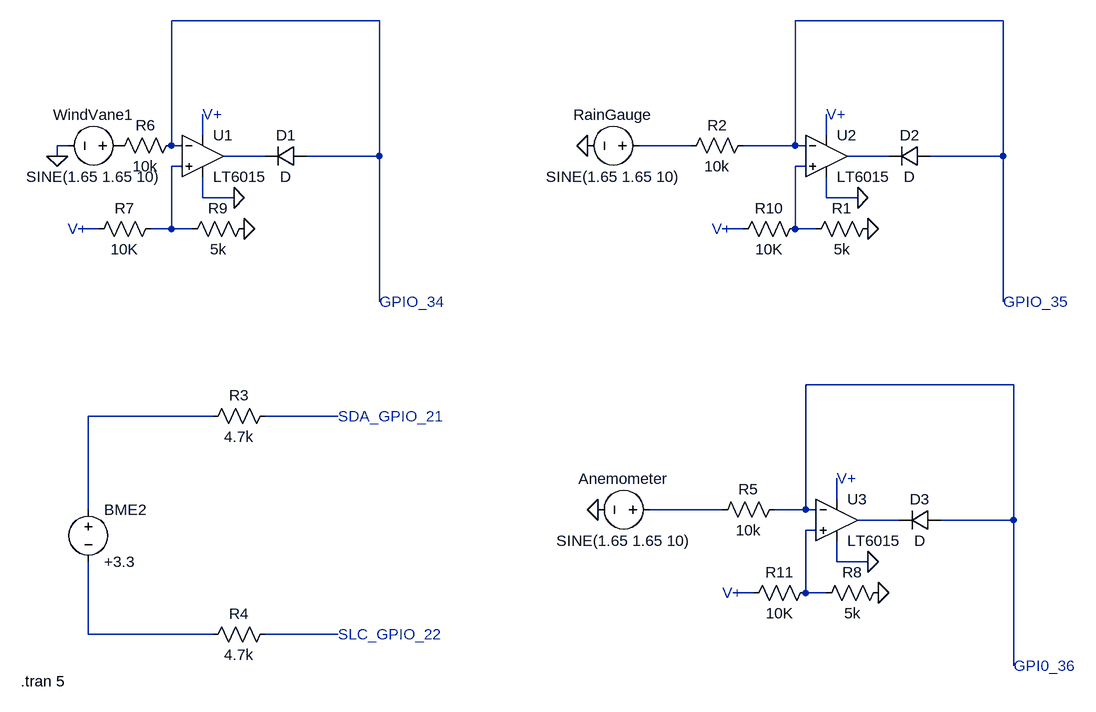
[diagram p0: schematic CircuitoAcopleCompleto.asc]
CircuitoAcopleCompleto.asc, the LTspice schematic file:
Version 4.1
SHEET 1 2424 1328
WIRE 912 -96 592 -96
WIRE 1872 -96 1552 -96
WIRE 640 80 640 48
WIRE 1600 80 1600 48
WIRE 432 96 416 96
WIRE 592 96 592 -96
WIRE 608 96 592 96
WIRE 1392 96 1312 96
WIRE 1552 96 1552 -96
WIRE 1552 96 1472 96
WIRE 1568 96 1552 96
WIRE 416 112 416 96
WIRE 736 112 672 112
WIRE 912 112 912 -96
WIRE 912 112 800 112
WIRE 1696 112 1632 112
WIRE 1872 112 1872 -96
WIRE 1872 112 1760 112
WIRE 608 128 592 128
WIRE 1568 128 1552 128
WIRE 640 176 640 144
WIRE 688 176 640 176
WIRE 1600 176 1600 144
WIRE 1648 176 1600 176
WIRE 480 224 448 224
WIRE 592 224 592 128
WIRE 592 224 560 224
WIRE 624 224 592 224
WIRE 1472 224 1440 224
WIRE 1552 224 1552 128
WIRE 1584 224 1552 224
WIRE 912 336 912 112
WIRE 1872 336 1872 112
WIRE 1888 464 1568 464
WIRE 656 512 464 512
WIRE 848 512 736 512
WIRE 1616 640 1616 608
WIRE 464 656 464 512
WIRE 1440 656 1328 656
WIRE 1568 656 1568 464
WIRE 1568 656 1520 656
WIRE 1584 656 1568 656
WIRE 1712 672 1648 672
WIRE 1888 672 1888 464
WIRE 1888 672 1776 672
WIRE 1584 688 1568 688
WIRE 1616 736 1616 704
WIRE 1664 736 1616 736
WIRE 1488 784 1456 784
WIRE 1568 784 1568 688
WIRE 1600 784 1568 784
WIRE 464 848 464 736
WIRE 656 848 464 848
WIRE 848 848 736 848
WIRE 1888 896 1888 672
FLAG 1232 96 0
FLAG 1248 656 0
FLAG 1664 224 0
FLAG 1648 176 0
FLAG 1680 784 0
FLAG 1664 736 0
FLAG 416 112 0
FLAG 704 224 0
FLAG 688 176 0
SYMBOL voltage 1328 96 R90
WINDOW 0 -32 56 VBottom 2
WINDOW 3 32 56 VTop 2
WINDOW 123 0 0 Left 0
WINDOW 39 0 0 Left 0
SYMATTR InstName RainGauge
SYMATTR Value SINE(1.65 1.65 10)
SYMBOL res 1488 80 R90
WINDOW 0 0 56 VBottom 2
WINDOW 3 32 56 VTop 2
SYMATTR InstName R2
SYMATTR Value 10k
SYMBOL voltage 1344 656 R90
WINDOW 0 -32 56 VBottom 2
WINDOW 3 32 56 VTop 2
WINDOW 123 0 0 Left 0
WINDOW 39 0 0 Left 0
SYMATTR InstName Anemometer
SYMATTR Value SINE(1.65 1.65 10)
SYMBOL res 1536 640 R90
WINDOW 0 0 56 VBottom 2
WINDOW 3 32 56 VTop 2
SYMATTR InstName R5
SYMATTR Value 10k
SYMBOL OpAmps\\LT6015 1600 112 R0
SYMATTR InstName U2
SYMBOL res 1680 208 R90
WINDOW 0 0 56 VBottom 2
WINDOW 3 32 56 VTop 2
SYMATTR InstName R1
SYMATTR Value 5k
SYMBOL diode 1760 96 R90
WINDOW 0 0 32 VBottom 2
WINDOW 3 32 32 VTop 2
SYMATTR InstName D2
SYMBOL OpAmps\\LT6015 1616 672 R0
SYMATTR InstName U3
SYMBOL res 1696 768 R90
WINDOW 0 0 56 VBottom 2
WINDOW 3 32 56 VTop 2
SYMATTR InstName R8
SYMATTR Value 5k
SYMBOL diode 1776 656 R90
WINDOW 0 0 32 VBottom 2
WINDOW 3 32 32 VTop 2
SYMATTR InstName D3
SYMBOL res 608 80 R90
WINDOW 0 0 56 VBottom 2
WINDOW 3 32 56 VTop 2
SYMATTR InstName R6
SYMATTR Value 10k
SYMBOL voltage 528 96 R90
WINDOW 0 -32 56 VBottom 2
WINDOW 3 32 56 VTop 2
WINDOW 123 0 0 Left 0
WINDOW 39 0 0 Left 0
SYMATTR InstName WindVane1
SYMATTR Value SINE(1.65 1.65 10)
SYMBOL OpAmps\\LT6015 640 112 R0
SYMATTR InstName U1
SYMBOL res 576 208 R90
WINDOW 0 0 56 VBottom 2
WINDOW 3 32 56 VTop 2
SYMATTR InstName R7
SYMATTR Value 10K
SYMBOL res 720 208 R90
WINDOW 0 0 56 VBottom 2
WINDOW 3 32 56 VTop 2
SYMATTR InstName R9
SYMATTR Value 5k
SYMBOL diode 800 96 R90
WINDOW 0 0 32 VBottom 2
WINDOW 3 32 32 VTop 2
SYMATTR InstName D1
SYMBOL voltage 464 640 R0
SYMATTR InstName BME2
SYMATTR Value +3.3
SYMBOL res 752 496 R90
WINDOW 0 0 56 VBottom 2
WINDOW 3 32 56 VTop 2
SYMATTR InstName R3
SYMATTR Value 4.7k
SYMBOL res 752 832 R90
WINDOW 0 0 56 VBottom 2
WINDOW 3 32 56 VTop 2
SYMATTR InstName R4
SYMATTR Value 4.7k
SYMBOL res 1568 208 R90
WINDOW 0 0 56 VBottom 2
WINDOW 3 32 56 VTop 2
SYMATTR InstName R10
SYMATTR Value 10K
SYMBOL res 1584 768 R90
WINDOW 0 0 56 VBottom 2
WINDOW 3 32 56 VTop 2
SYMATTR InstName R11
SYMATTR Value 10K
TEXT 1600 48 Left 2 ;V+
TEXT 1616 608 Left 2 ;V+
TEXT 912 336 Left 2 ;GPIO_34
TEXT 640 48 Left 2 ;V+
TEXT 432 224 Left 2 ;V+
TEXT 848 512 Left 2 ;SDA_GPIO_21
TEXT 848 848 Left 2 ;SLC_GPIO_22
TEXT 1872 336 Left 2 ;GPIO_35
TEXT 1888 896 Left 2 ;GPI0_36
TEXT 1424 224 Left 2 ;V+
TEXT 1440 784 Left 2 ;V+
TEXT 360 920 Left 2 !.tran 5

The netlist it stands for:
* CircuitoAcopleCompleto.asc
V§RainGauge N005 0 SINE(1.65 1.65 10)
R2 N002 N005 10k
V§Anemometer N016 0 SINE(1.65 1.65 10)
R5 N012 N016 10k
X§U2 N009 N002 N004 0 N007 LT6016  ; LT6015, pins In+ In- V+ V- OUT
R1 0 N009 5k
D2 N002 N007 D
X§U3 N018 N012 N015 0 N017 LT6016  ; LT6015, pins In+ In- V+ V- OUT
R8 0 N018 5k
D3 N012 N017 D
R6 N001 P001 10k
V§WindVane1 P001 0 SINE(1.65 1.65 10)
X§U1 N008 N001 N003 0 N006 LT6016  ; LT6015, pins In+ In- V+ V- OUT
R7 N008 N010 10K
R9 0 N008 5k
D1 N001 N006 D
V§BME2 N013 N020 +3.3
R3 N014 N013 4.7k
R4 N021 N020 4.7k
R10 N009 N011 10K
R11 N018 N019 10K
.model D D
.lib standard.dio
* V+
* V+
* GPIO_34
* V+
* V+
* SDA_GPIO_21
* SLC_GPIO_22
* GPIO_35
* GPI0_36
* V+
* V+
.tran 5
.lib LTC2.lib
.backanno
.end